# Altium schematic sheet Monitor.SchDoc
size 299 x 149 mm; DocumentNumber: 8; SheetNumber: 8; SheetTotal: 11
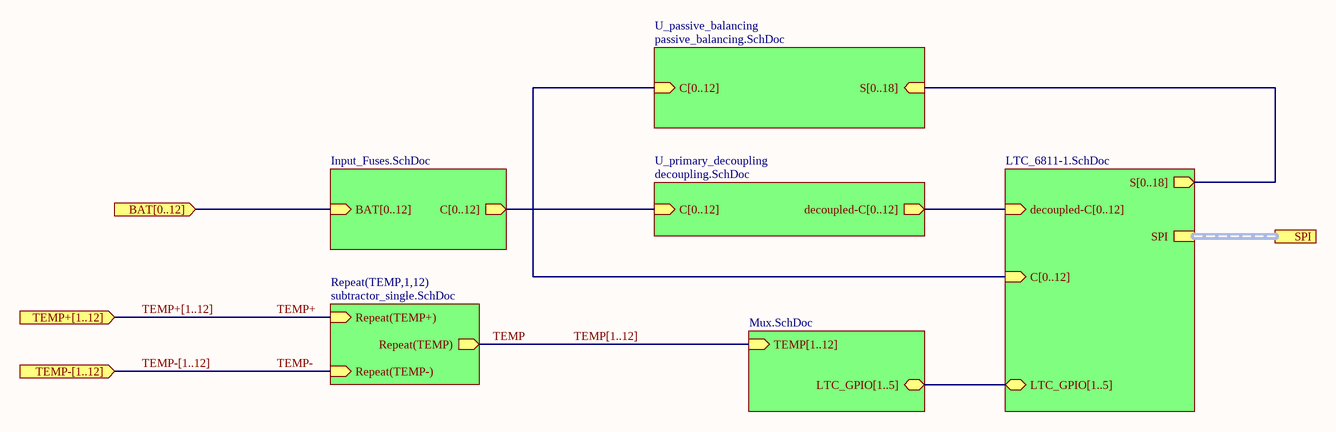
[diagram p0: Monitor.SchDoc]

## Sub-sheets
Repeat(TEMP,1,12) = subtractor_single.SchDoc: Repeat(TEMP+) (in), Repeat(TEMP) (out), Repeat(TEMP-) (in)
S5 = Input_Fuses.SchDoc: BAT[0..12] (in), C[0..12] (out)
S6 = LTC_6811-1.SchDoc: LTC_GPIO[1..5] (bidir), SPI (harness SPI), S[0..18] (out), decoupled-C[0..12] (in), C[0..12] (in)
S7 = Mux.SchDoc: TEMP[1..12] (in), LTC_GPIO[1..5] (bidir)
U_passive_balancing = passive_balancing.SchDoc: S[0..18] (in), C[0..12] (in)
U_primary_decoupling = decoupling.SchDoc: C[0..12] (in), decoupled-C[0..12] (out)

## Ports
BAT[0..12] (in), SPI (harness SPI), TEMP+[1..12] (in), TEMP-[1..12] (in)

## Nets
TEMP: sheet Repeat(TEMP,1,12)/Repeat(TEMP)
TEMP+: sheet Repeat(TEMP,1,12)/Repeat(TEMP+)
TEMP-: sheet Repeat(TEMP,1,12)/Repeat(TEMP-)

## Buses and harness runs
bus port BAT[0..12] = sheet S5/BAT[0..12]
bus sheet S5/C[0..12] = sheet S6/C[0..12] = sheet U_passive_balancing/C[0..12] = sheet U_primary_decoupling/C[0..12]
bus sheet S6/decoupled-C[0..12] = sheet U_primary_decoupling/decoupled-C[0..12]
bus sheet S6/LTC_GPIO[1..5] = sheet S7/LTC_GPIO[1..5]
bus sheet S6/S[0..18] = sheet U_passive_balancing/S[0..18]
bus TEMP+[1..12] = port TEMP+[1..12]
bus TEMP-[1..12] = port TEMP-[1..12]
bus TEMP[1..12] = sheet S7/TEMP[1..12]
harness port SPI = sheet S6/SPI